# EAGLE design TA_v2_Deck (EAGLE 9.6.2)
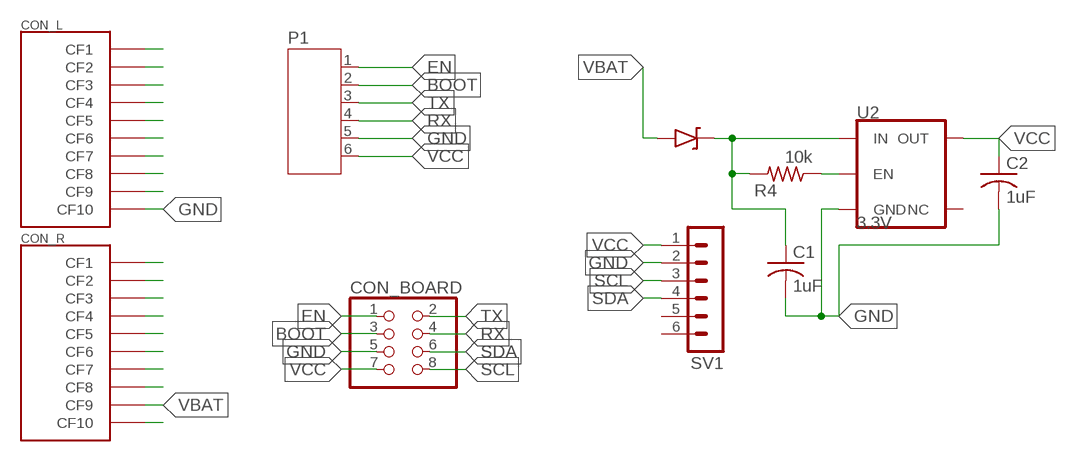
[diagram p0: schematic, sheet 1]

## Parts
C1  1uF  C-USC0805  [C0805]
C2  1uF  C-USC0805  [C0805]
CON_BOARD  PINHD-2X4  [2X04]
CON_L  FEMALE_CON  [FEMALE_HEADER_2]
CON_R  FEMALE_CON  [FEMALE_HEADER_2]
P1  JST-PH6  [JST-PH6]
R4  10k  R-US_R0603  [R0603]
SV1  MA06-1  [MA06-1]
U2  3.3V  V_REG_AP2112K-3.3V  [SOT23-5]
U$2  1N5819  [SOT-323]

## Nets
BOOT: CON_BOARD.3 P1.2
EN: CON_BOARD.1 P1.1
GND: C1.2 C2.2 CON_BOARD.5 CON_L.CF10 P1.5 SV1.2 U2.2(GND)
N$1: CON_R.CF10
N$2: C1.1 R4.2 U2.1(IN) U$2.K
N$3: CON_R.CF8
N$4: CON_R.CF7
N$5: CON_R.CF6
N$6: R4.1 U2.3(EN)
N$8: CON_R.CF5
N$9: CON_R.CF4
N$10: CON_R.CF3
N$11: CON_R.CF2
N$12: CON_R.CF1
N$14: CON_L.CF9
N$15: CON_L.CF8
N$16: CON_L.CF7
N$17: CON_L.CF6
N$18: CON_L.CF5
N$19: CON_L.CF4
N$20: CON_L.CF3
N$21: CON_L.CF2
N$22: CON_L.CF1
RX: CON_BOARD.4 P1.4
SCL: CON_BOARD.8 SV1.3
SDA: CON_BOARD.6 SV1.4
TX: CON_BOARD.2 P1.3
VBAT: CON_R.CF9 U$2.A
VCC: C2.1 CON_BOARD.7 P1.6 SV1.1 U2.5(OUT)
Unconnected: SV1.5 SV1.6 U2.4(NC)

## Library data of the parts
C1 C2 = rcl:C-US: CAPACITOR, American symbol; SPICEPREFIX: C
CON_BOARD = pinhead:PINHD-2X4: PIN HEADER
CON_L CON_R = crazyflie_lib:FEMALE_CON
P1 = jst-ph:JST-PH6
R4 = rcl:R-US_: RESISTOR, American symbol; SPICEPREFIX: R
SV1 = con-lstb:MA06-1: PIN HEADER; OC_FARNELL: unknown; OC_NEWARK: unknown
U2 = AP2112:V_REG_AP2112: AP2112 - 600mA CMOS LDO Regulator w/ Enable The AP2112 is CMOS process low dropout linear regulator with enable function, the regulator delivers a guaranteed 600mA (min.) continuous load current. Features Output Voltage Accuracy: ±1.5% Output Current: 600mA (Min.) Foldback Short Current Protection: 50mA Enable Function to Turn ON/OFF VOUT Low Dropout Voltage (3.3V): 250mV (Typ.) @IOUT=600mA Excellent Load Regulation: 0.2%/A (Typ.) Excellent Line Regulation: 0.02%/V (Typ.) Low Quiescent Current: 55μA (Typ.) Low Standby Current: 0.01μA (Typ.) Low Output Noise: 50μVRMS PSRR: 100Hz -65dB, 1kHz -65dB OTSD Protection Stable with 1.0μF Flexible Cap: Ceramic, Tantalum and Aluminum Electrolytic Operation Temperature Range: -40°C to 85°C ESD: MM 400V, HBM 4000V; PROD_ID: VREG-12457
U$2 = Diodes:1N5819

## Board
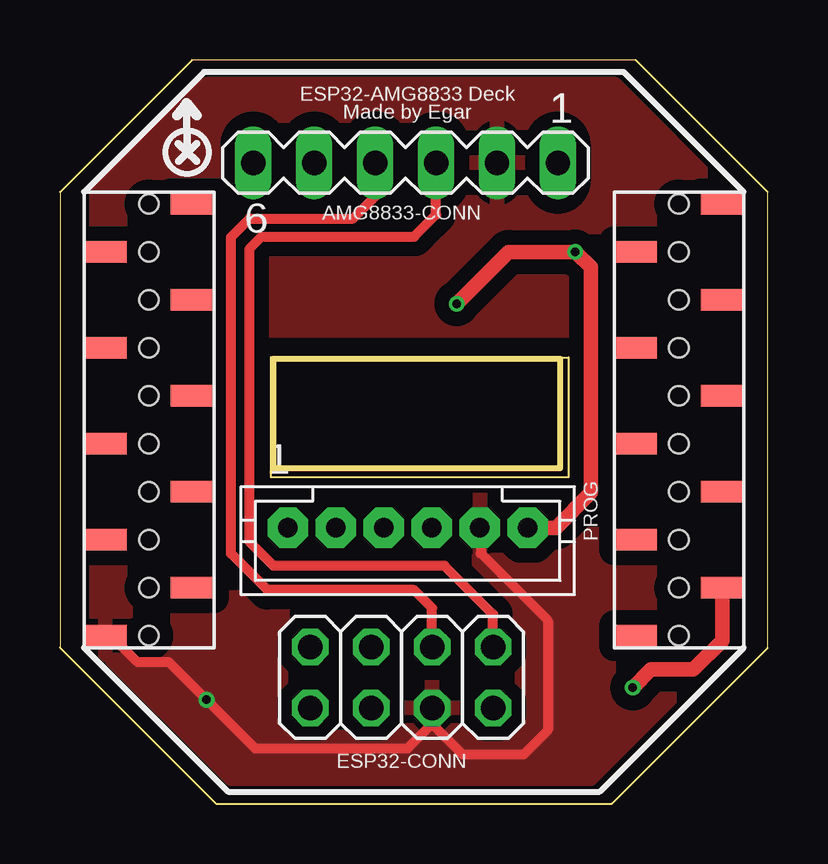
[diagram p1: board, top side]
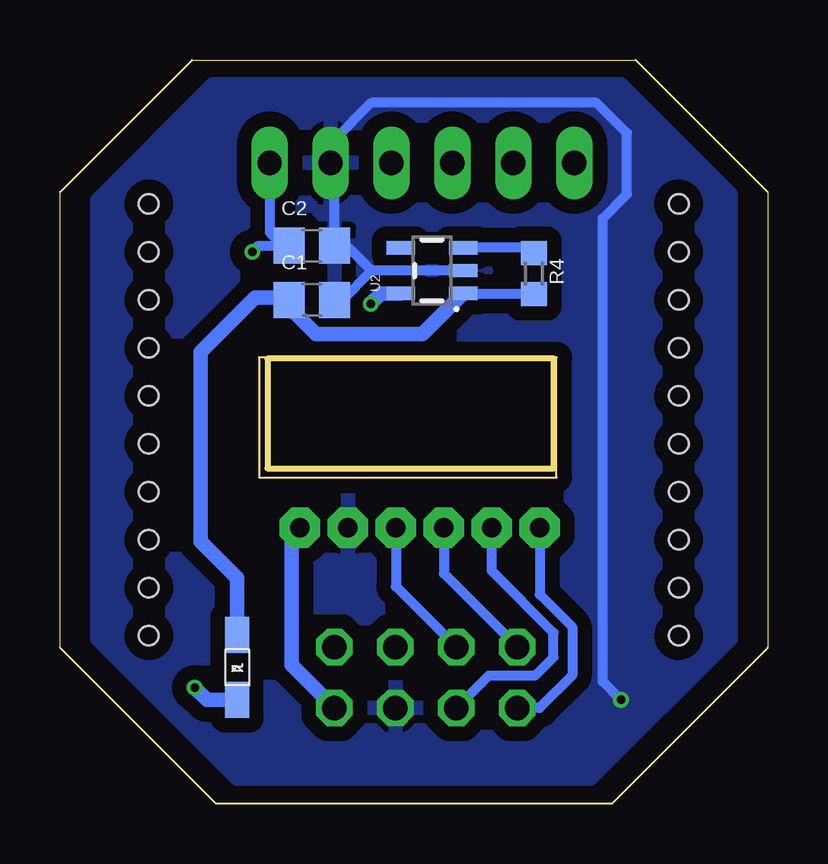
[diagram p2: board, bottom side, seen from below]

Size 29.5 x 31 mm. Coordinates in mm from the lower left corner, seen from the top.
Outline: 0,25.5 0,6.5 6.5,0 23,0 29.5,6.5 29.5,25.5 24,31 5.5,31 0,25.5
Outline: 8.8,18.6 21.2,18.6 21.2,13.6 8.8,13.6 8.8,18.6
Copper layers (1*16): Top 0.035mm / dielectric 1.6mm / Bottom 0.035mm
Design rules "Elecrow_2-layer_PCB_eagle_rule": minimum track width 6mil, minimum drill 12mil, track to track 6mil, track to pad 6mil, pad to pad 6mil, via to via 8mil, smd to smd 0mil, copper to edge 20mil, drill to drill 10mil, minimum pad ring 6mil, minimum via ring 6mil, stop-mask expansion 0mil, vias tented up to drill 100mil, thermal gap 10mil
tRestrict: area 8.7,13.7 to 21.1,18.8
Milling: area 8.9,14 to 20.8,18.6

### Footprints (pad centres in the part's own frame; a part is rotated, then mirrored left to right if it is on the bottom)
C0805 = smd 1.3 x 1.5: 1 -0.95,0; 2 0.95,0
2X04 = drill 1.016 octagon: 1 -3.81,-1.27; 2 -3.81,1.27; 3 -1.27,-1.27; 4 -1.27,1.27; 5 1.27,-1.27; 6 1.27,1.27; 7 3.81,-1.27; 8 3.81,1.27
FEMALE_HEADER_2 = smd 0.9 x 1.8: CF1 -8.996,1.818; CF2 -6.996,-1.812; CF3 -4.996,1.818; CF4 -2.996,-1.812; CF5 -0.996,1.818; CF6 1.004,-1.812; CF7 3.004,1.818; CF8 5.004,-1.812; CF9 7.004,1.818; CF10 9.004,-1.812 | hole 0.8: 1,0; -1,0; -3,0; -5,0; -7,0; -9,0; 3,0; 5,0; 7,0; 9,0
JST-PH6 = drill 0.813 pad 1.676 octagon: 1 5,0; 2 3,0; 3 1,0; 4 -1,0; 5 -3,0; 6 -5,0
R0603 = smd 1 x 1.1: 1 -0.85,0; 2 0.85,0
MA06-1 = drill 1.016 long: 1 -6.35,0; 2 -3.81,0; 3 -1.27,0; 4 1.27,0; 5 3.81,0; 6 6.35,0
SOT23-5 = smd 0.55 x 1.2: 1 -0.95,-1.3; 2 0,-1.3; 3 0.95,-1.3; 4 0.95,1.3; 5 -0.95,1.3
SOT-323 = smd 1.5 x 1: A 1.3,0; K -1.4,0

### Placement (x,y rotation side)
C1  19,21 0 bottom
C2  19,23.25 0 bottom
CON_BOARD  14.25,5.25 0 top
CON_L  3.7,16 270 top
CON_R  25.8,16 270 top
P1  14.5,11.5 180 top
R4  9.74,22.09 270 bottom
SV1  14.41,26.71 180 top
U2  13.99,22.22 90 bottom
U$2  22.1,5.62 270 bottom

### Tracks (layer width: path | path; a pad name or v marks a point on that pad's centre or on a via)
BOOT
  Bottom 0.406: CON_BOARD.3 11.62,5.34 9.68,5.34 8.92,6.1 8.92,7.12 11.5,9.7 P1.2
EN
  Bottom 0.406: P1.1 9.5,8.71 8.14,7.36 8.14,5.34 9.5,3.98 CON_BOARD.1
GND  (via drill 0.35)
  Top 0.406: 15.52,3.32 CON_BOARD.5 | 15.52,3.32 14.49,2.29 8.14,2.29 v6.11,4.33 4.55,5.89 3.24,5.89 2.13,7 CON_L.CF10 | P1.5 17.54,11.46 17.54,10.42 20.34,7.63 20.34,3.06 19.32,2.04 16.79,2.04 15.52,3.32
  Bottom 0.406: U2.2 16.51,22.22 | 16.51,22.22 17.54,23.25 C2.2 18.05,26.54 18.12,26.61 | C1.2 17.73,21 16.51,22.22 | 18.12,26.61 SV1.2 | v6.11,4.33 6.87,5.09 6.87,24.39 5.86,25.41 5.86,27.95 7.13,29.22 16.53,29.22 18.12,27.62 18.12,26.61
  pour Bottom (isolate 0.61): 1.54,25.41 6.11,29.98 23.13,29.98 27.96,25.15 27.96,6.87 22.11,1.02 7.38,1.02 1.54,6.87
  pour Top (isolate 0.61): 1.54,25.41 6.11,29.98 23.13,29.98 27.96,25.15 27.96,6.87 22.11,1.02 7.13,1.02 1.54,6.61
N$2
  Bottom 0.254: 12.66,21.24 U2.1
  Bottom 0.406: R4.2 12.66,21.24 | 20.04,21.09 C1.1 19.95,20.69
  Bottom 0.61: 20.04,21.09 21.37,21.09 23.64,18.82 23.64,10.93 22.11,9.4 U$2.K | U2.1 14.39,19.57 18.83,19.57 19.95,20.69
N$6
  Bottom 0.406: R4.1 9.97,23.17 U2.3
RX
  Bottom 0.406: P1.4 15.5,9.05 CON_BOARD.4
SCL
  Top 0.406: CON_BOARD.8 18.06,7.89 16.03,9.91 8.91,9.91 7.89,10.93 7.89,23.11 8.41,23.63 14.76,23.63 15.68,24.55 SV1.3
SDA
  Top 0.406: CON_BOARD.6 15.52,8.15 14.76,8.9 8.65,8.9 7.13,10.42 7.13,23.61 7.91,24.39 12.22,24.39 13.14,25.31 SV1.4
TX
  Bottom 0.406: P1.3 13.5,9.59 CON_BOARD.2
VBAT  (via drill 0.35)
  Top 0.406: CON_R.CF9 27.43,8.81
  Top 0.61: v23.88,4.83 24.64,5.59 26.42,5.59 27.62,6.79 CON_R.CF9
  Bottom 0.61: v23.88,4.83 23.38,4.32 U$2.A
VCC  (via drill 0.35)
  Top 0.406: v21.47,23 21.49,23
  Top 0.61: 21.49,23 22.13,22.36 22.13,12.96 20.67,11.5 P1.6 | v16.54,20.84 18.71,23 v21.47,23
  Bottom 0.152: 20.76,23.97 20.76,23.81 | 19.96,23.01 C2.1
  Bottom 0.406: SV1.1 20.76,23.97 | 20.76,23.81 19.96,23.01 | v21.47,23 21.22,23.25 C2.1
  Bottom 0.61: CON_BOARD.7 19.84,5.77 19.84,11.16 P1.6 | U2.5 16.11,21.27 v16.54,20.84

### Text on the board
tNames: ESP32-AMG8833 Deck / Made by Egar | AMG8833-CONN | PROG | ESP32-CONN